# Altium schematic sheet esc32.SchDoc
size A4
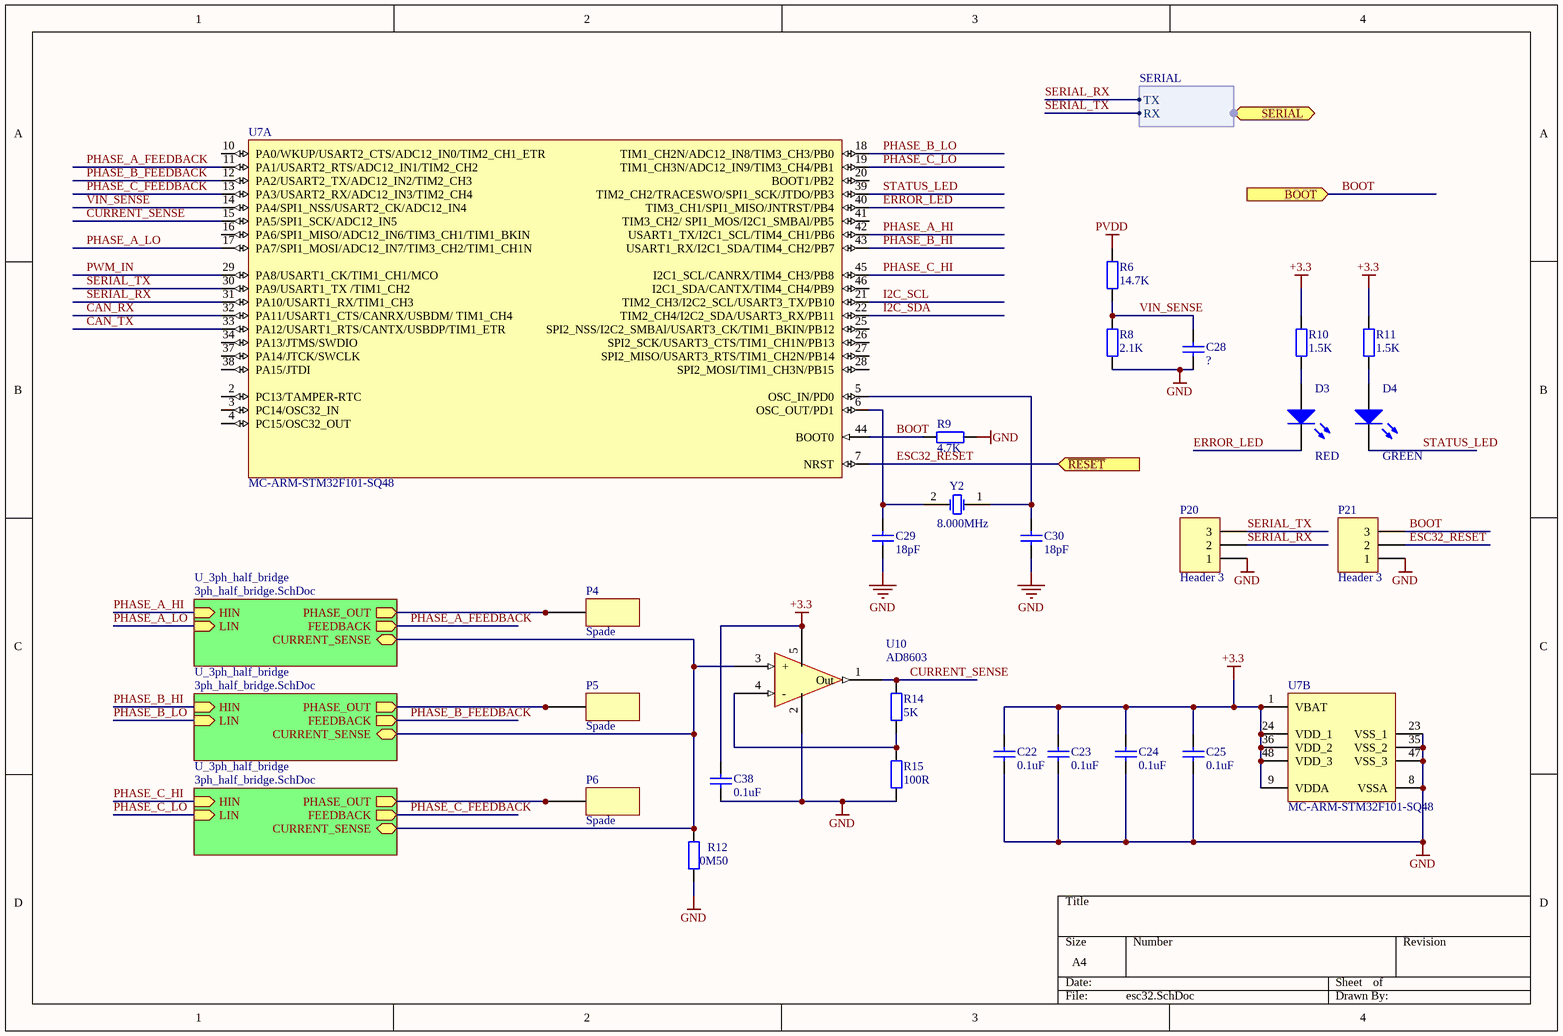
[diagram p0: esc32.SchDoc]

## Parts
C22  value 0.1uF  [C0603]  (hidden comment: Cap)
C23  value 0.1uF  [C0603]  (hidden comment: Cap)
C24  value 0.1uF  [C0603]  (hidden comment: Cap)
C25  value 0.1uF  [C0603]  (hidden comment: Cap)
C28  Cap  [C0603]  (value not drawn)
C29  value 18pF  [C0603]  (hidden comment: Cap)
C30  value 18pF  [C0603]  (hidden comment: Cap)
C38  value 0.1uF  [C0603]  (hidden comment: Cap)
D3  value RED  [LGQ971]
D4  value GREEN  [LGQ971]
P4  Spade  [3866A]
P5  Spade  [3866A]
P6  Spade  [3866A]
P20  Header 3  [HDR1X3]
P21  Header 3  [HDR1X3]
R6  value 14.7K  [R0603]  (hidden comment: Res)
R8  value 2.1K  [R0603]  (hidden comment: Res)
R9  value 4.7K  [R0603]  (hidden comment: Res)
R10  value 1.5K  [R0603]  (hidden comment: Res)
R11  value 1.5K  [R0603]  (hidden comment: Res)
R12  value 0M50  [TLR3A]  (hidden comment: Res)
R14  value 5K  [R0603]  (hidden comment: Res)
R15  value 100R  [R0603]  (hidden comment: Res)
U7  MC-ARM-STM32F101-SQ48  [LQFP48_L]  (parts A,B of 2)
U10  AD8603  [SOT95P255X100-5N]
Y2  value 8.000MHz  [C3E-24.000-12-3030-X]  (hidden comment: XTAL)

## Sub-sheets
U_3ph_half_bridge = 3ph_half_bridge.SchDoc: PHASE_OUT (out), HIN (in), LIN (in), FEEDBACK (out), CURRENT_SENSE
U_3ph_half_bridge = 3ph_half_bridge.SchDoc: PHASE_OUT (out), HIN (in), LIN (in), FEEDBACK (out), CURRENT_SENSE
U_3ph_half_bridge = 3ph_half_bridge.SchDoc: PHASE_OUT (out), HIN (in), LIN (in), FEEDBACK (out), CURRENT_SENSE

## Ports
BOOT (in), SERIAL (harness SERIAL), ~{RESET} (in)

## Harnesses
SERIAL: TX, RX

## Nets
+3.3: C22.1 C23.1 C24.1 C25.1 C38.1 R10.2 R11.2 U7.1(VBAT) U7.9(VDDA) U7.24(VDD_1) U7.36(VDD_2) U7.48(VDD_3) U10.5(V+)
GND: C22.2 C23.2 C24.2 C25.2 C28.2 C29.2 C30.2 C38.2 P20.1 P21.1 R8.1 R9.1 R12.2 R15.1 U7.8(VSSA) U7.23(VSS_1) U7.35(VSS_2) U7.47(VSS_3) U10.2(V-)
PVDD: R6.2
BOOT: P21.3 R9.2 U7.44(BOOT0) ; port BOOT
CAN_RX: U7.32(PA11/USART1_CTS/CANRX/USBDM/_TIM1_CH4)
CAN_TX: U7.33(PA12/USART1_RTS/CANTX/USBDP/TIM1_ETR)
CURRENT_SENSE: R14.2 U7.15(PA5/SPI1_SCK/ADC12_IN5) U10.1(Out)
ERROR_LED: D3.2(K) U7.40(TIM3_CH1/SPI1_MISO/JNTRST/PB4)
ESC32_RESET: P21.2 U7.7(NRST) ; port ~{RESET}
I2C_SCL: U7.21(TIM2_CH3/I2C2_SCL/USART3_TX/PB10)
I2C_SDA: U7.22(TIM2_CH4/I2C2_SDA/USART3_RX/PB11)
PHASE_A_FEEDBACK: U7.11(PA1/USART2_RTS/ADC12_IN1/TIM2_CH2) ; sheet U_3ph_half_bridge/FEEDBACK
PHASE_A_HI: U7.42(USART1_TX/I2C1_SCL/TIM4_CH1/PB6) ; sheet U_3ph_half_bridge/HIN
PHASE_A_LO: U7.17(PA7/SPI1_MOSI/ADC12_IN7/TIM3_CH2/TIM1_CH1N) ; sheet U_3ph_half_bridge/LIN
PHASE_B_FEEDBACK: U7.12(PA2/USART2_TX/ADC12_IN2/TIM2_CH3) ; sheet U_3ph_half_bridge/FEEDBACK
PHASE_B_HI: U7.43(USART1_RX/I2C1_SDA/TIM4_CH2/PB7) ; sheet U_3ph_half_bridge/HIN
PHASE_B_LO: U7.18(TIM1_CH2N/ADC12_IN8/TIM3_CH3/PB0) ; sheet U_3ph_half_bridge/LIN
PHASE_C_FEEDBACK: U7.13(PA3/USART2_RX/ADC12_IN3/TIM2_CH4) ; sheet U_3ph_half_bridge/FEEDBACK
PHASE_C_HI: U7.45(I2C1_SCL/CANRX/TIM4_CH3/PB8) ; sheet U_3ph_half_bridge/HIN
PHASE_C_LO: U7.19(TIM1_CH3N/ADC12_IN9/TIM3_CH4/PB1) ; sheet U_3ph_half_bridge/LIN
PWM_IN: U7.29(PA8/USART1_CK/TIM1_CH1/MCO)
SERIAL_RX: P20.2 U7.31(PA10/USART1_RX/TIM1_CH3) ; port SERIAL.TX
SERIAL_TX: P20.3 U7.30(PA9/USART1_TX_/TIM1_CH2) ; port SERIAL.RX
STATUS_LED: D4.2(K) U7.39(TIM2_CH2/TRACESWO/SPI1_SCK/JTDO/PB3)
VIN_SENSE: C28.1 R6.1 R8.2 U7.14(PA4/SPI1_NSS/USART2_CK/ADC12_IN4)
NetC29_1: C29.1 U7.6(OSC_OUT/PD1) Y2.2(OSC2)
NetC30_1: C30.1 U7.5(OSC_IN/PD0) Y2.1(OSC1)
NetD3_1: D3.1(A) R10.1
NetD4_1: D4.1(A) R11.1
NetP4_1: P4.1 P4.2 ; sheet U_3ph_half_bridge/PHASE_OUT
NetP5_1: P5.1 P5.2 ; sheet U_3ph_half_bridge/PHASE_OUT
NetP6_1: P6.1 P6.2 ; sheet U_3ph_half_bridge/PHASE_OUT
NetR12_1: R12.1 U10.3(+) ; sheet U_3ph_half_bridge/CURRENT_SENSE, sheet U_3ph_half_bridge/CURRENT_SENSE, sheet U_3ph_half_bridge/CURRENT_SENSE
NetR14_1: R14.1 R15.2 U10.4(-)

Not connected (* = marked no-connect by the designer): U7 2(PC13/TAMPER-RTC) 3(PC14/OSC32_IN) 4(PC15/OSC32_OUT) 10(PA0/WKUP/USART2_CTS/ADC12_IN0/TIM2_CH1_ETR) 16(PA6/SPI1_MISO/ADC12_IN6/TIM3_CH1/TIM1_BKIN) 20(BOOT1/PB2) 25(SPI2_NSS/I2C2_SMBAl/USART3_CK/TIM1_BKIN/PB12) 26(SPI2_SCK/USART3_CTS/TIM1_CH1N/PB13) 27(SPI2_MISO/USART3_RTS/TIM1_CH2N/PB14) 28(SPI2_MOSI/TIM1_CH3N/PB15) 34(PA13/JTMS/SWDIO) 37(PA14/JTCK/SWCLK) 38(PA15/JTDI) 41(TIM3_CH2/_SPI1_MOS/I2C1_SMBAl/PB5) 46(I2C1_SDA/CANTX/TIM4_CH4/PB9)

## Library data of the parts
C22-C25 C28-C30 C38 = Cap: Capacitor
  C22-C25 C38: farnell: 9406140
  C28: Value: ?
  C29 C30: farnell: 1759056
D3 D4 = LED2: Typical RED, GREEN, YELLOW, AMBER GaAs LED; farnell: 1226372
P4-P6 = 3866A: Space connector; Farnell PN: 3625588
P20 P21 = Header 3: Header, 3-Pin; LatestRevisionDate: 17-Jul-2002; LatestRevisionNote: Re-released for DXP Platform.; Publisher: Altium Limited
R6 R8-R12 R14 R15 = Res2: Resistor
  R9: farnell: 9331247
  R10 R11: farnell: 9330607
U10 = AD8603: Precision op-amp; farnell: 1651290
Y2 = XTAL: Crystal Oscillator
U7 = MC-ARM-STM32F101-SQ48: farnell: 2215215